# EAGLE design rgb_led_attiny (EAGLE 9.2.2)
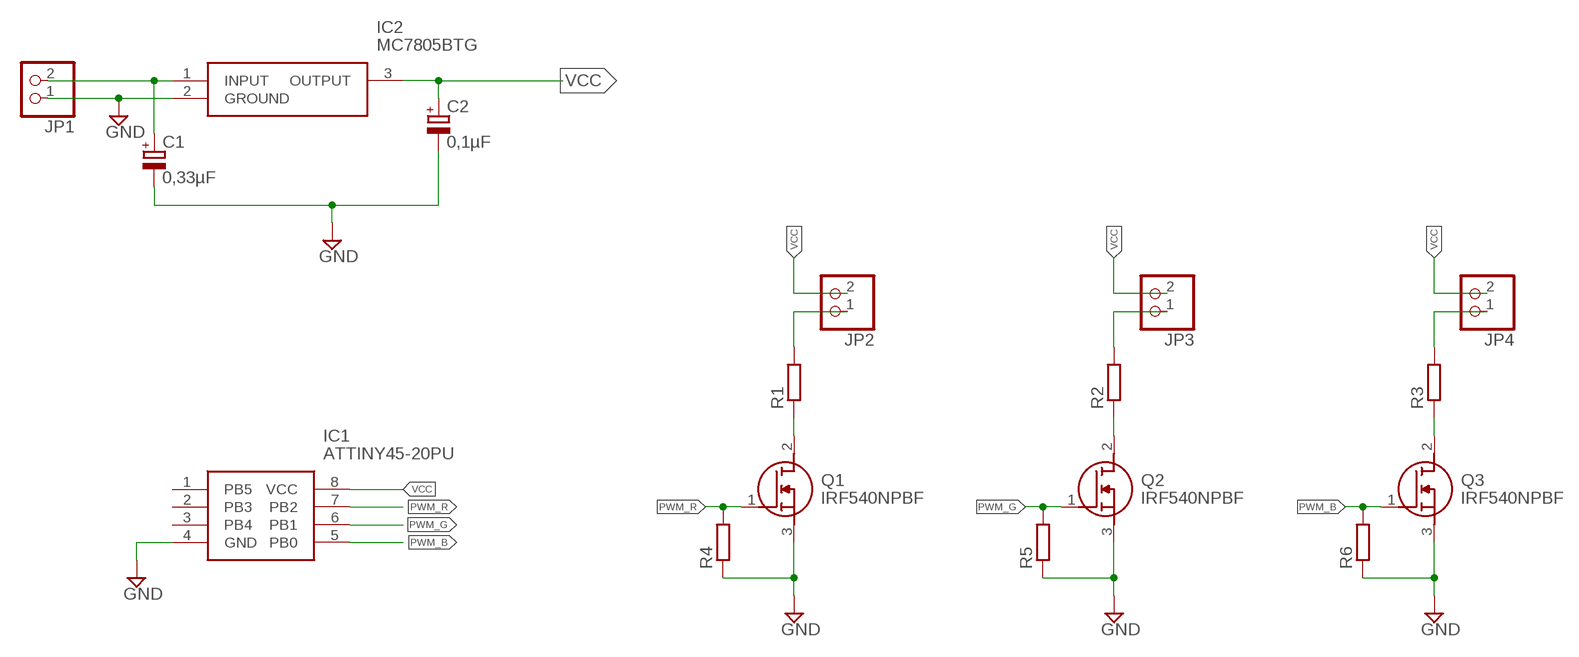
[diagram p0: schematic, sheet 1]

## Parts
C1  0,33µF  CPOL-EUE2.5-6  [E2,5-6]
C2  0,1µF  CPOL-EUE2.5-6  [E2,5-6]
IC1  ATTINY45-20PU  [DIP254P762X533-8]
IC2  MC7805BTG  [TO254P482X997X2018-3P]
JP1  PINHD-1X2  [1X02]
JP2  PINHD-1X2  [1X02]
JP3  PINHD-1X2  [1X02]
JP4  PINHD-1X2  [1X02]
Q1  IRF540NPBF  [TO254P469X1042X1967-3P]
Q2  IRF540NPBF  [TO254P469X1042X1967-3P]
Q3  IRF540NPBF  [TO254P469X1042X1967-3P]
R1  R-EU_0613/5V  [P0613V]
R2  R-EU_0613/5V  [P0613V]
R3  R-EU_0613/5V  [P0613V]
R4  R-EU_0207/10  [0207/10]
R5  R-EU_0207/10  [0207/10]
R6  R-EU_0207/10  [0207/10]

## Nets
GND: C1.- C2.- IC1.4(GND) IC2.2(GROUND) JP1.1 Q1.3(S) Q2.3(S) Q3.3(S) R4.1 R5.1 R6.1
N$1: C1.+ IC2.1(INPUT) JP1.2
N$2: Q2.2(D) R2.1
N$3: Q1.2(D) R1.1
N$4: JP2.1 R1.2
N$5: JP3.1 R2.2
N$6: Q3.2(D) R3.1
N$7: JP4.1 R3.2
PWM_B: IC1.5(PB0) Q3.1(G) R6.2
PWM_G: IC1.6(PB1) Q2.1(G) R5.2
PWM_R: IC1.7(PB2) Q1.1(G) R4.2
VCC: C2.+ IC1.8(VCC) IC2.3(OUTPUT) JP2.2 JP3.2 JP4.2
Unconnected: IC1.1(PB5) IC1.2(PB3) IC1.3(PB4)

## Library data of the parts
C1 C2 = rcl:CPOL-EU: POLARIZED CAPACITOR, European symbol; SPICEPREFIX: C
IC1 = rgb_led_attiny:ATTINY45-20PU: 8-bit Microcontroller with 2/4/8KBytes In-System Programmable Flash Source: Datasheet <http://componentsearchengine.com/Datasheets/3/ATTINY45-20PU.pdf>; DESCRIPTION: 8-bit Microcontroller with 2/4/8KBytes In-System Programmable Flash; HEIGHT: mm; MANUFACTURER_NAME: Microchip; MANUFACTURER_PART_NUMBER: ATTINY45-20PU; MOUSER_PART_NUMBER: 556-ATTINY45-20PU; MOUSER_PRICE-STOCK: https://www.mouser.com/Search/Refine.aspx?Keyword=556-ATTINY45-20PU; RS_PART_NUMBER: 1331643P; RS_PRICE-STOCK: http://uk.rs-online.com/web/p/products/1331643P
IC2 = rgb_led_attiny:MC7805BTG: Voltage regulator,MC7805BT 5V 1A ON Semiconductor MC7805BTG, Single Linear Voltage Regulator, 1A 5 V, +/-4%, 3-Pin TO-220 Source: Datasheet <http://www.onsemi.com/pub_link/Collateral/MC7800-D.PDF>; ALLIED_NUMBER: 70099955; ALLIED_PRICE-STOCK: http://www.alliedelec.com/on-semiconductor-mc7805btg/70099955/; DESCRIPTION: Voltage regulator,MC7805BT 5V 1A ON Semiconductor MC7805BTG, Single Linear Voltage Regulator, 1A 5 V, +/-4%, 3-Pin TO-220; HEIGHT: 4.82mm; MANUFACTURER_NAME: ON Semiconductor; MANUFACTURER_PART_NUMBER: MC7805BTG; MOUSER_PART_NUMBER: 863-MC7805BTG; MOUSER_PRICE-STOCK: https://www.mouser.com/Search/Refine.aspx?Keyword=863-MC7805BTG; RS_PART_NUMBER: 5165821P; RS_PRICE-STOCK: http://uk.rs-online.com/web/p/products/5165821P
JP1-JP4 = pinhead:PINHD-1X2: PIN HEADER
Q1-Q3 = rgb_led_attiny:IRF540NPBF: MOSFET N-Channel 100V 33A TO220AB International Rectifier IRF540NPBF N-channel MOSFET Transistor, 33 A, 100 V, 3-Pin TO-220AB Source: Datasheet <https://www.infineon.com/dgdl/irf540n.pdf?fileId=5546d462533600a4015355e396cb199f>; DESCRIPTION: MOSFET N-Channel 100V 33A TO220AB International Rectifier IRF540NPBF N-channel MOSFET Transistor, 33 A, 100 V, 3-Pin TO-220AB; HEIGHT: 4.69mm; MANUFACTURER_NAME: International Rectifier; MANUFACTURER_PART_NUMBER: IRF540NPBF; RS_PART_NUMBER: 2509058159; RS_PRICE-STOCK: http://uk.rs-online.com/web/p/products/2509058159
R1-R6 = rcl:R-EU_: RESISTOR, European symbol; SPICEPREFIX: R

## Board
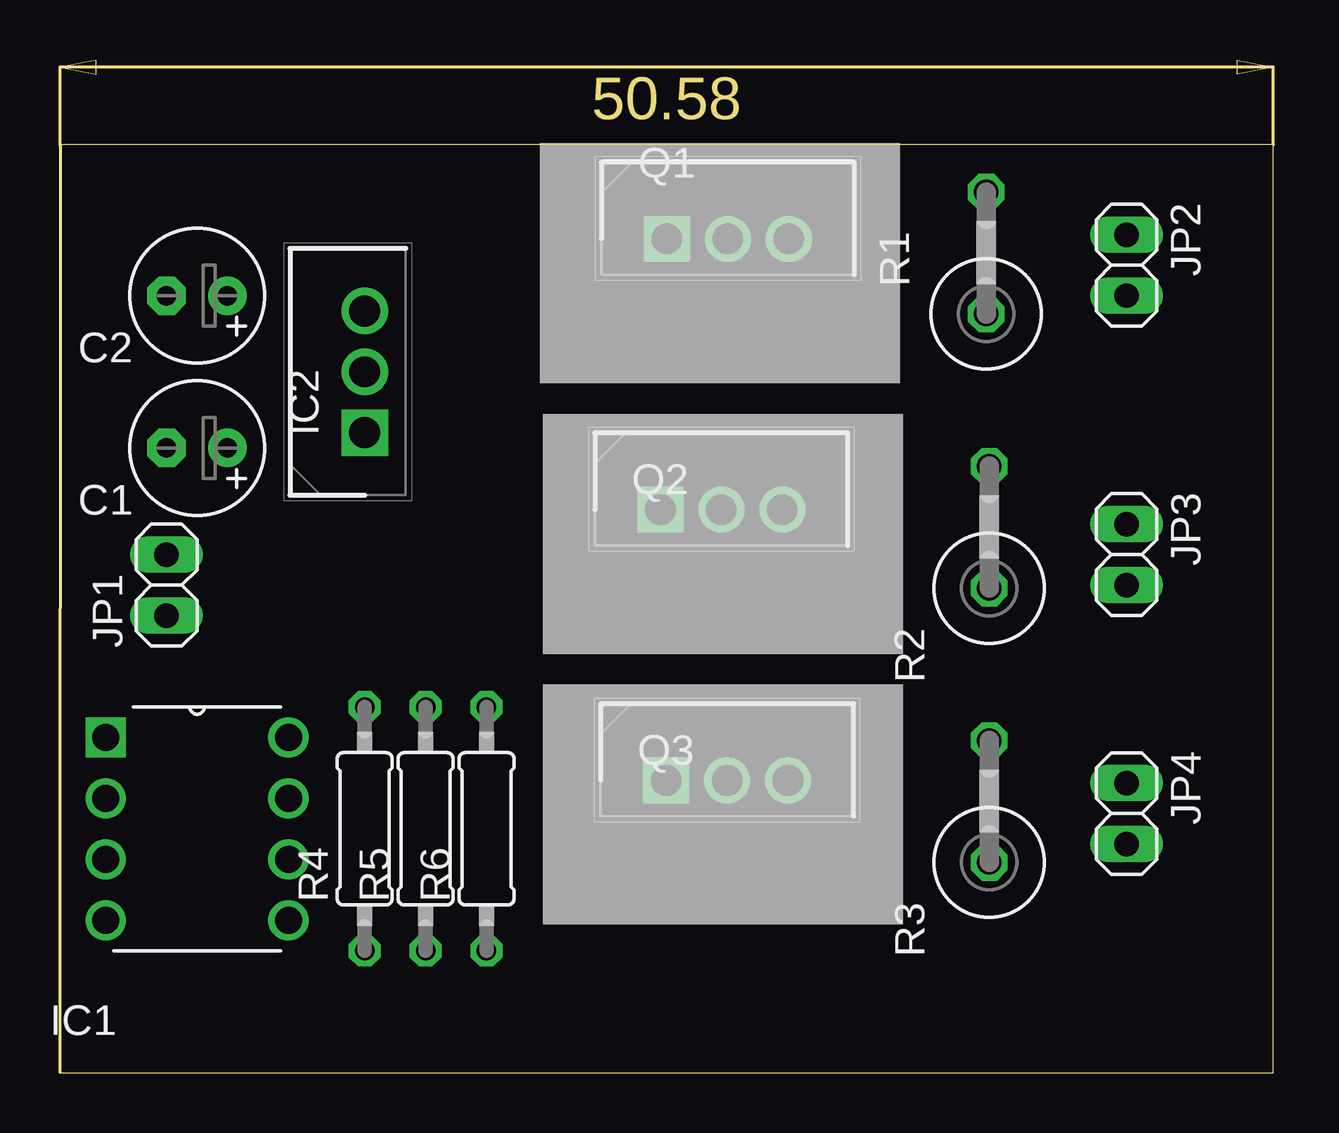
[diagram p1: board, top side]
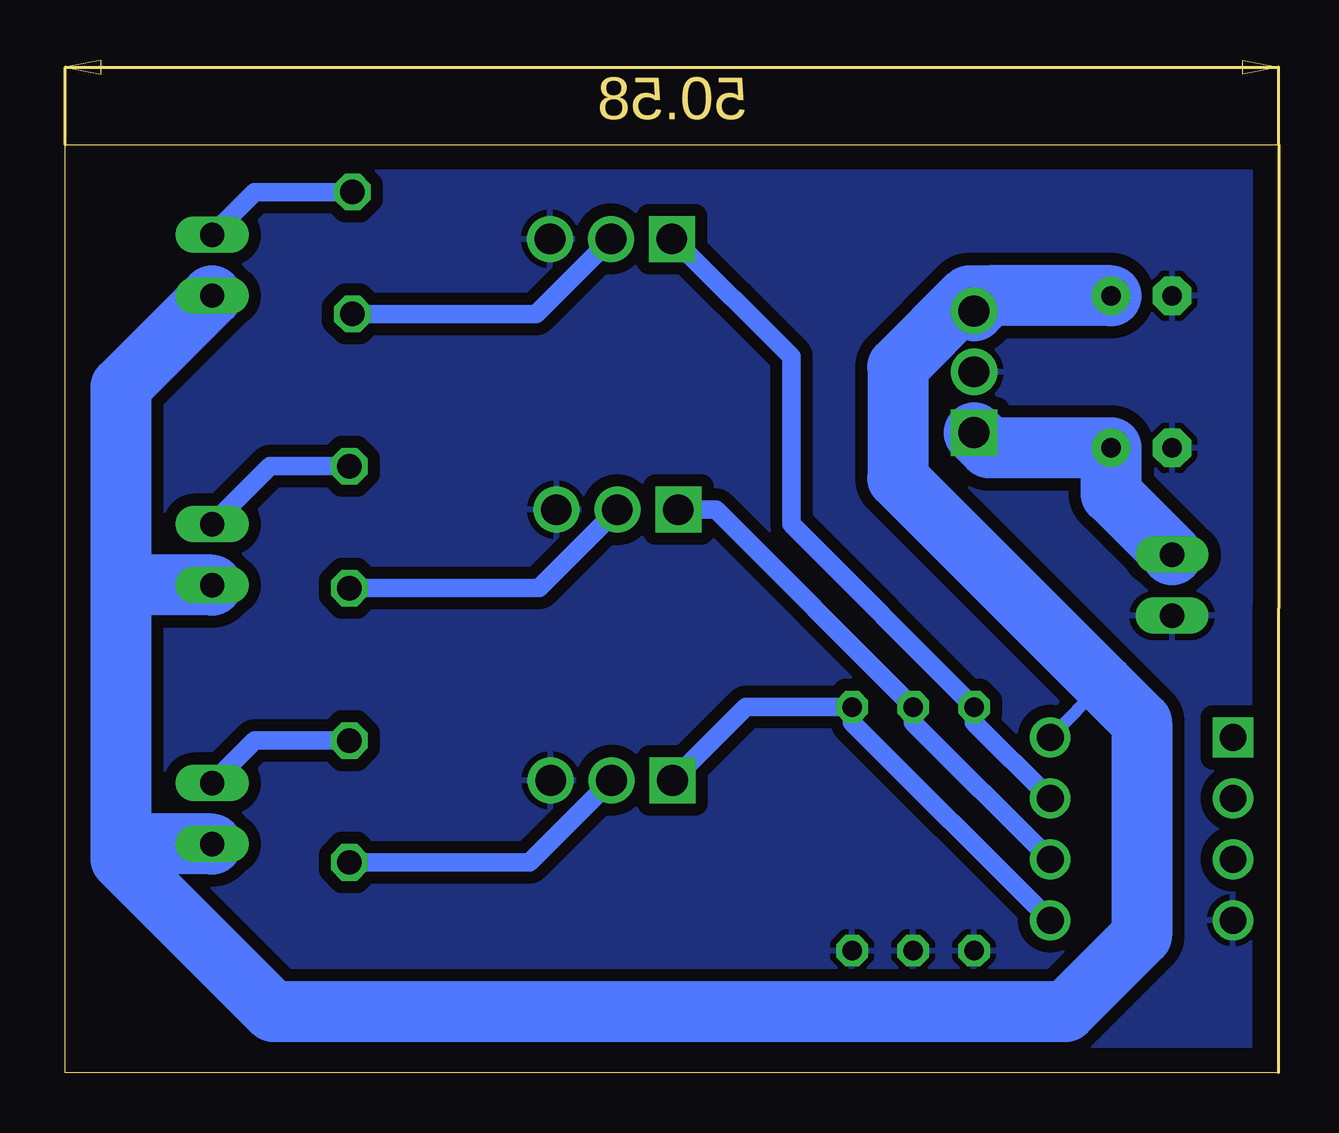
[diagram p2: board, bottom side, seen from below]

Size 50.58 x 38.68 mm. Coordinates in mm from the lower left corner, seen from the top.
Outline: 0,0 50.58,0 50.58,38.68 0,38.68 0,0
Copper layers (1*16): Top 0.035mm / dielectric 1.5mm / Bottom 0.035mm
Design rules "default": minimum track width 6mil, minimum drill 0.35mm, track to track 6mil, track to pad 6mil, pad to pad 6mil, via to via 6mil, smd to smd 6mil, copper to edge 40mil, drill to drill 6mil, minimum pad ring 10mil, minimum via ring 8mil, stop-mask expansion 4mil, vias tented up to drill 0mil, thermal gap 10mil

### Footprints (pad centres in the part's own frame; a part is rotated, then mirrored left to right if it is on the bottom)
E2,5-6 = drill 0.813 pad 1.6: + -1.27,0 | drill 0.813 pad 1.6 octagon: - 1.27,0
DIP254P762X533-8 = drill 1.118 pad 1.676 square: 1 -7.62,7.62 | drill 1.118 pad 1.676: 2 -7.62,5.08; 3 -7.62,2.54; 4 -7.62,0; 5 0,0; 6 0,2.54; 7 0,5.08; 8 0,7.62
TO254P482X997X2018-3P = drill 1.29 pad 1.935 square: 1 0,0 | drill 1.29 pad 1.935: 2 2.54,0; 3 5.08,0
1X02 = drill 1.016 long: 1 -1.27,0; 2 1.27,0
TO254P469X1042X1967-3P = drill 1.28 pad 1.92 square: 1 0,0 | drill 1.28 pad 1.92: 2 2.54,0; 3 5.08,0
P0613V = drill 1.016 octagon: 1 -2.54,0; 2 2.54,0
0207/10 = drill 0.813 octagon: 1 -5.08,0; 2 5.08,0

### Placement (x,y rotation side)
C1  5.71,26.04 180 top
C2  5.71,32.39 180 top
IC1  9.53,6.35 0 top
IC2  12.7,26.67 90 top
JP1  4.45,20.32 90 top
JP2  44.46,33.66 270 top
JP3  44.46,21.59 270 top
JP4  44.46,10.79 270 top
Q1  25.3,34.75 0 top
Q2  25.03,23.47 0 top
Q3  25.27,12.18 0 top
R1  38.61,34.16 90 top
R2  38.74,22.73 90 top
R3  38.74,11.3 90 top
R4  12.7,10.16 90 top
R5  15.24,10.16 90 top
R6  17.78,10.16 90 top

### Tracks (layer width: path | path; a pad name or v marks a point on that pad's centre or on a via)
GND
  pour Bottom (isolate 0.508): -1.27,-5.08 52.07,-5.08 52.07,40.64 -1.27,40.64
N$1
  Bottom 2.54: IC2.1 12.06,26.04 C1.+ 6.99,24.13 JP1.2
N$2
  Bottom 0.762: Q2.2 30.84,20.19 R2.1
N$3
  Bottom 0.762: Q1.2 30.96,31.62 R1.1
N$4
  Bottom 0.762: R1.2 42.68,36.7 JP2.1
N$5
  Bottom 0.762: R2.2 42.05,25.27 JP3.1
N$6
  Bottom 0.762: Q3.2 31.22,8.76 R3.1
N$7
  Bottom 0.762: R3.2 42.68,13.84 JP4.1
PWM_B
  Bottom 0.762: IC1.5 17.78,14.61 R6.2 22.21,15.24 Q3.1
PWM_G
  Bottom 0.762: IC1.6 15.24,14.61 R5.2 23.46,23.47 Q2.1
PWM_R
  Bottom 0.762: Q1.1 25.23,34.75 20.32,29.84 20.32,22.86 R4.2 12.7,14.61 IC1.7
VCC
  Bottom 0.508: IC1.8 7.3,16.19
  Bottom 2.54: C2.+ 12.06,32.39 | 12.06,32.39 IC2.3 | 12.06,32.39 12.9,32.39 15.88,29.41 15.88,24.77 7.3,16.19 5.71,14.61 5.71,5.72 8.89,2.54 41.91,2.54 48.26,8.89 48.26,9.53 | JP2.2 48.26,28.58 48.26,20.32 | 48.26,20.32 48.26,9.53 | JP4.2 48.26,9.53 | JP3.2 48.26,20.32